# Altium schematic sheet STM32_MCU.SchDoc
size B
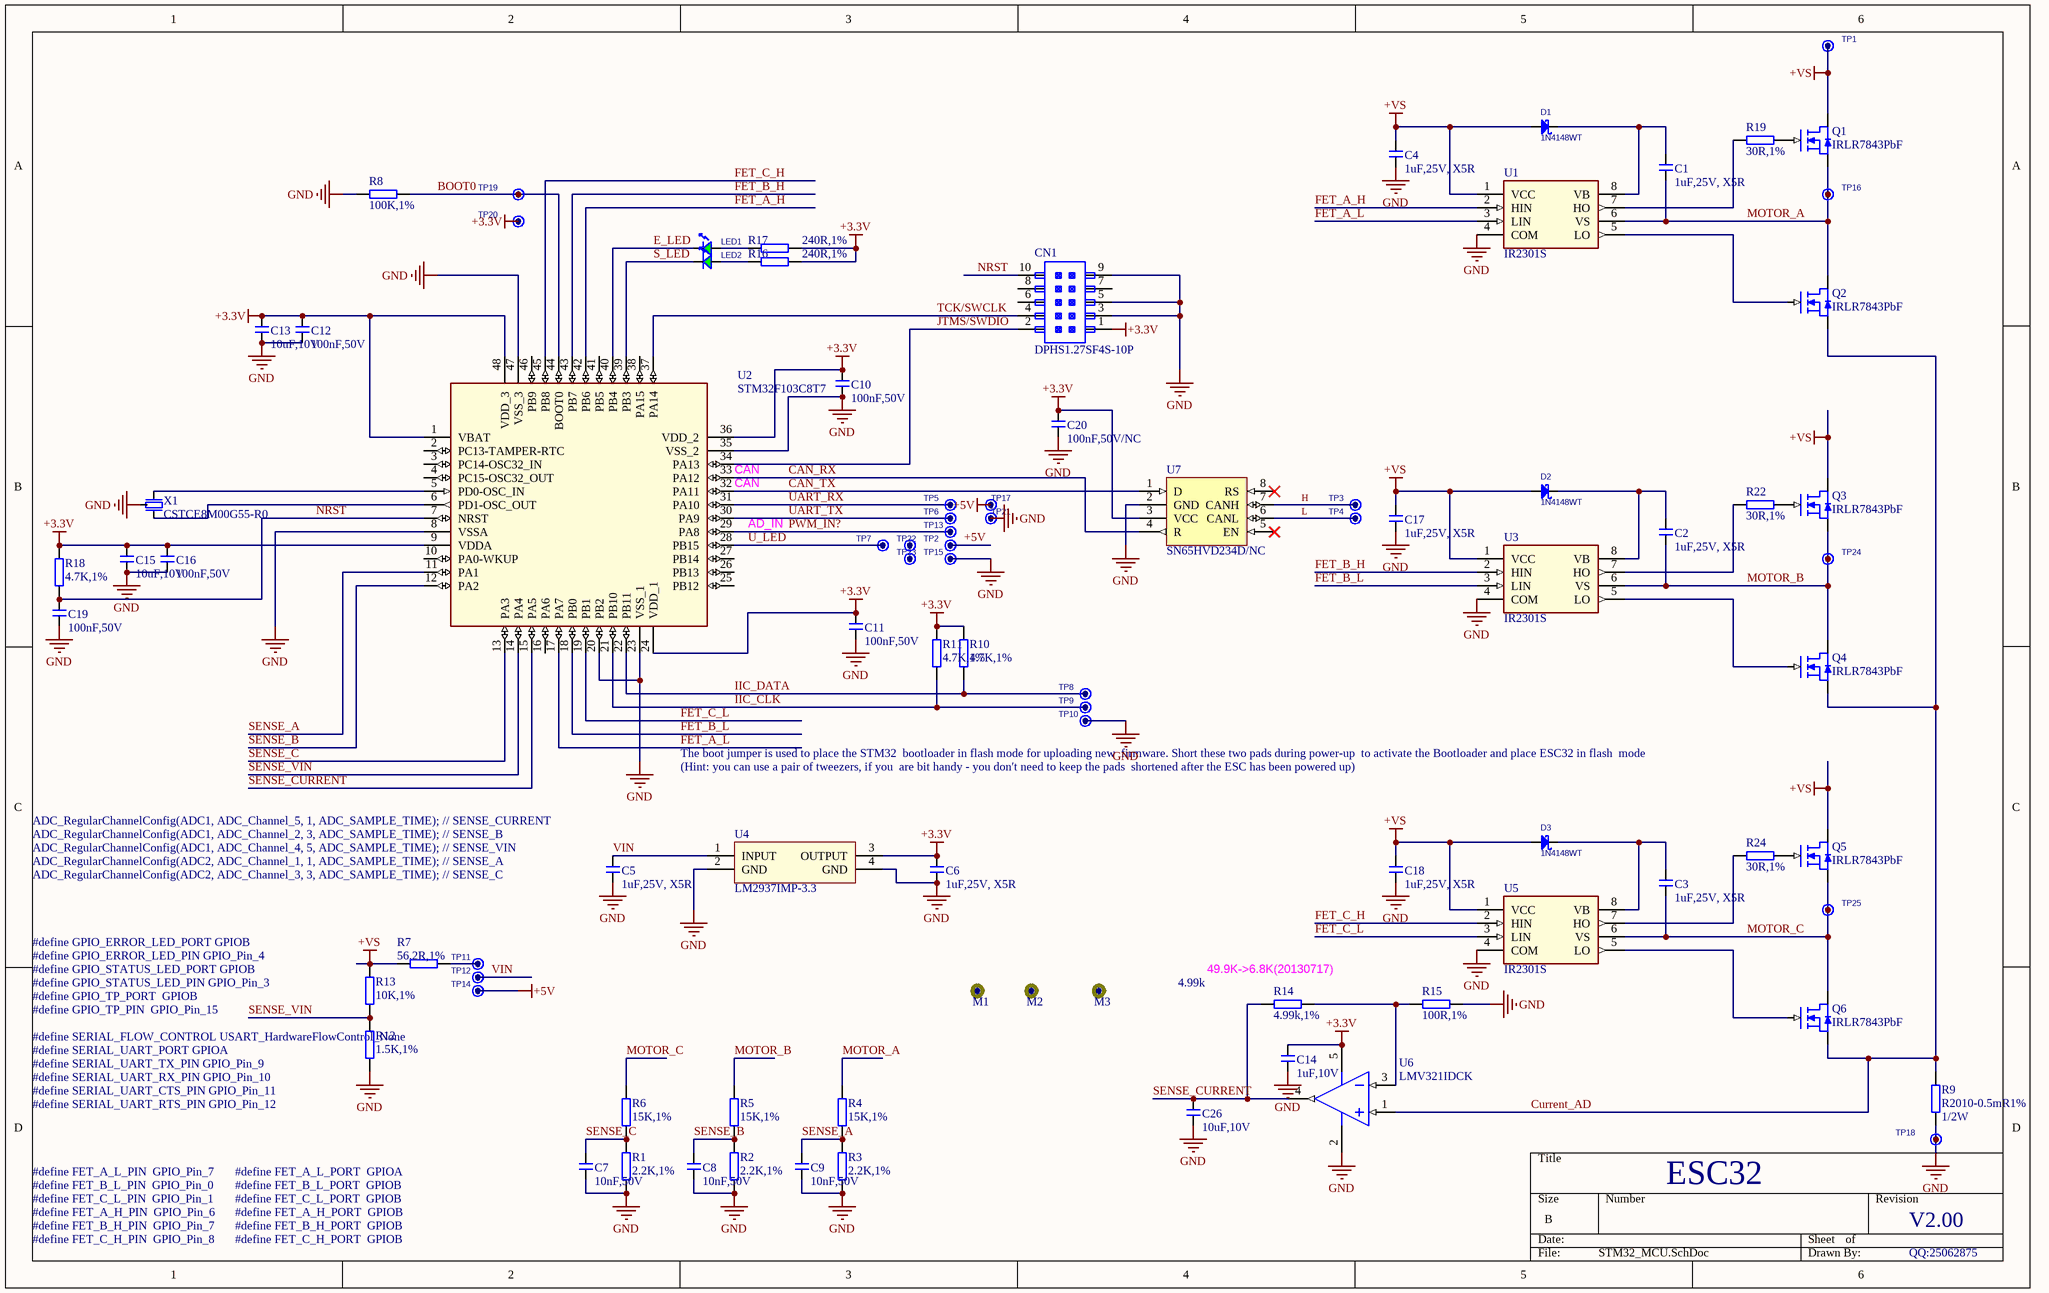
[diagram p0: STM32_MCU.SchDoc]

## Parts
C1  value 1uF,25V, X5R  [CAPC2012L]  (hidden comment: C0805-1uF/25V)
C2  value 1uF,25V, X5R  [CAPC2012L]  (hidden comment: C0805-1uF/25V)
C3  value 1uF,25V, X5R  [CAPC2012L]  (hidden comment: C0805-1uF/25V)
C4  value 1uF,25V, X5R  [CAPC2012L]  (hidden comment: C0805-1uF/25V)
C5  value 1uF,25V, X5R  [CAPC2012L]  (hidden comment: C0805-1uF/25V)
C6  value 1uF,25V, X5R  [CAPC2012L]  (hidden comment: C0805-1uF/25V)
C7  value 10nF,50V  [CAPC1608L]  (hidden comment: C0603-10nF/50V)
C8  value 10nF,50V  [CAPC1608L]  (hidden comment: C0603-10nF/50V)
C9  value 10nF,50V  [CAPC1608L]  (hidden comment: C0603-10nF/50V)
C10  value 100nF,50V  [CAPC1608L]  (hidden comment: C0603-100nF/50V)
C11  value 100nF,50V  [CAPC1608L]  (hidden comment: C0603-100nF/50V)
C12  value 100nF,50V  [CAPC1608L]  (hidden comment: C0603-100nF/50V)
C13  value 10uF,10V  [CAPC1608L]  (hidden comment: C0603-10uF/10V)
C14  value 1uF,10V  [CAPC1608L]  (hidden comment: C0603-1uF/10V)
C15  value 10uF,10V  [CAPC1608L]  (hidden comment: C0603-10uF/10V)
C16  value 100nF,50V  [CAPC1608L]  (hidden comment: C0603-100nF/50V)
C17  value 1uF,25V, X5R  [CAPC2012L]  (hidden comment: C0805-1uF/25V)
C18  value 1uF,25V, X5R  [CAPC2012L]  (hidden comment: C0805-1uF/25V)
C19  value 100nF,50V  [CAPC1608L]  (hidden comment: C0603-100nF/50V)
C20  value 100nF,50V/NC  [CAPC1608L]  (hidden comment: C0603-100nF/50V/NC)
C26  value 10uF,10V  [CAPC1608L]  (hidden comment: C0603-10uF/10V)
CN1  DPHS1.27SF4S-10P  [DPHS1.27SF4S-10P]
D1  1N4148WT  [DIOM1608X06N]
D2  1N4148WT  [DIOM1608X06N]
D3  1N4148WT  [DIOM1608X06N]
LED1  LED-R0603  [LED-G0603]  (value not drawn)
LED2  LED-G0603  [LED-G0603]  (value not drawn)
M1  MarkPad  [MarkPad]  (value not drawn)  (no BOM)
M2  MarkPad  [MarkPad]  (value not drawn)  (no BOM)
M3  MarkPad  [MarkPad]  (value not drawn)  (no BOM)
Q1  IRLR7843PbF  [TO230P990X239-3N]
Q2  IRLR7843PbF  [TO230P990X239-3N]
Q3  IRLR7843PbF  [TO230P990X239-3N]
Q4  IRLR7843PbF  [TO230P990X239-3N]
Q5  IRLR7843PbF  [TO230P990X239-3N]
Q6  IRLR7843PbF  [TO230P990X239-3N]
R1  value 2.2K,1%  [RESC1608L]  (hidden comment: R0603-2.2K)
R2  value 2.2K,1%  [RESC1608L]  (hidden comment: R0603-2.2K)
R3  value 2.2K,1%  [RESC1608L]  (hidden comment: R0603-2.2K)
R4  value 15K,1%  [RESC1608L]  (hidden comment: R0603-15K)
R5  value 15K,1%  [RESC1608L]  (hidden comment: R0603-15K)
R6  value 15K,1%  [RESC1608L]  (hidden comment: R0603-15K)
R7  value 56.2R,1%  [RESC2012L]  (hidden comment: R0805-56.2R)
R8  value 100K,1%  [RESC1608L]  (hidden comment: R0603-100K)
R9  R2010-0.5mR1%  功?: 1/2W  [RC2010-5025X07N]
R10  value 4.7K,1%  [RESC1608L]  (hidden comment: R0603-4.7K)
R11  value 4.7K,1%  [RESC1608L]  (hidden comment: R0603-4.7K)
R12  value 1.5K,1%  [RESC1608L]  (hidden comment: R0603-1.5K)
R13  value 10K,1%  [RESC1608L]  (hidden comment: R0603-10K)
R14  value 4.99k,1%  [RESC1608L]  (hidden comment: R0603-4.99k)
R15  value 100R,1%  [RESC1608L]  (hidden comment: R0603-100R)
R16  value 240R,1%  [RESC1608L]  (hidden comment: R0603-240R)
R17  value 240R,1%  [RESC1608L]  (hidden comment: R0603-240R)
R18  value 4.7K,1%  [RESC1608L]  (hidden comment: R0603-4.7K)
R19  value 30R,1%  [RESC1608L]  (hidden comment: R0603-30R)
R22  value 30R,1%  [RESC1608L]  (hidden comment: R0603-30R)
R24  value 30R,1%  [RESC1608L]  (hidden comment: R0603-30R)
TP1  TPS50mil  [TP3]  (value not drawn)  (no BOM)
TP2  TPS50mil  [TPS1.5mm]  (value not drawn)  (no BOM)
TP3  TPS50mil  [TPS1.5mm]  (value not drawn)  (no BOM)
TP4  TPS50mil  [TPS1.5mm]  (value not drawn)  (no BOM)
TP5  TPS50mil  [TPS1.5mm]  (value not drawn)  (no BOM)
TP6  TPS50mil  [TPS1.5mm]  (value not drawn)  (no BOM)
TP7  TPS50mil  [TPS1.5mm]  (value not drawn)  (no BOM)
TP8  TPS50mil  [TPS1.5mm]  (value not drawn)  (no BOM)
TP9  TPS50mil  [TPS1.5mm]  (value not drawn)  (no BOM)
TP10  TPS50mil  [TPS1.5mm]  (value not drawn)  (no BOM)
TP11  TPS50mil  [TP1]  (value not drawn)  (no BOM)
TP12  TPS50mil  [TP2]  (value not drawn)  (no BOM)
TP13  TPS50mil  [TPS1.5mm]  (value not drawn)  (no BOM)
TP14  TPS50mil  [TP1]  (value not drawn)  (no BOM)
TP15  TPS50mil  [TPS1.5mm]  (value not drawn)  (no BOM)
TP16  TPS50mil  [TP3]  (value not drawn)  (no BOM)
TP17  TPS50mil  [TPS1.5mm]  (value not drawn)  (no BOM)
TP18  TPS50mil  [TP3]  (value not drawn)  (no BOM)
TP19  TPS50mil  [TPS1.5mm]  (value not drawn)  (no BOM)
TP20  TPS50mil  [TPS1.5mm]  (value not drawn)  (no BOM)
TP21  TPS50mil  [TPS1.5mm]  (value not drawn)  (no BOM)
TP22  TPS50mil  [TPS1.5mm]  (value not drawn)  (no BOM)
TP23  TPS50mil  [TPS1.5mm]  (value not drawn)  (no BOM)
TP24  TPS50mil  [TP3]  (value not drawn)  (no BOM)
TP25  TPS50mil  [TP3]  (value not drawn)  (no BOM)
U1  IR2301S  [SOIC127P600X175-8L]
U2  STM32F103C8T7  [TSQFP50P900X900X160-48L]
U3  IR2301S  [SOIC127P600X175-8L]
U4  LM2937IMP-3.3  [SOT230P700X180-4N]
U5  IR2301S  [SOIC127P600X175-8L]
U6  LMV321IDCK  [SOT65P210X110-5L(SC70)]
U7  SN65HVD234D/NC  [SOIC127P600X175-8M]
X1  CSTCE8M00G55-R0  [CSTCE_G]

## Nets
+3.3V: C6.1 C10.1 C11.1 C12.1 C13.1 C14.1 C15.1 C16.1 C20.1 CN1.1 R10.2 R11.2 R16.2 R17.2 R18.2 TP20.1 U2.1(VBAT) U2.9(VDDA) U2.24(VDD_1) U2.36(VDD_2) U2.48(VDD_3) U4.3(OUTPUT) U6.5(V+) U7.3(VCC)
+5V: TP2.1 TP14.1 TP17.1
+VS: C4.1 C17.1 C18.1 D1.1(A) D2.1(A) D3.1(A) Q1.4(D) Q3.4(D) Q5.4(D) R7.2 R13.2 TP1.1 U1.1(VCC) U3.1(VCC) U5.1(VCC)
GND: C4.2 C5.2 C6.2 C7.2 C8.2 C9.2 C10.2 C11.2 C12.2 C13.2 C14.2 C15.2 C16.2 C17.2 C18.2 C19.2 C20.2 C26.2 CN1.3 CN1.5 CN1.9 R1.1 R2.1 R3.1 R8.2 R9.1 R12.1 R15.1 TP10.1 TP15.1 TP18.1 TP21.1 U1.4(COM) U2.8(VSSA) U2.20(PB2) U2.23(VSS_1) U2.35(VSS_2) U2.47(VSS_3) U3.4(COM) U4.2(GND) U4.4(GND) U5.4(COM) U6.2(GND) U7.2(GND) X1.2(GND)
BOOT0: R8.1 TP19.1 U2.44(BOOT0)
CAN_RX: U2.33(PA12) U7.4(R)
CAN_TX: U2.32(PA11) U7.1(D)
Current_AD: Q2.3(S) Q4.3(S) Q6.3(S) R9.2 U6.1(IN1+)
E_LED: LED1.2(K) U2.40(PB4)
FET_A_H: U1.2(HIN) U2.42(PB6)
FET_A_L: U1.3(LIN) U2.17(PA7)
FET_B_H: U2.43(PB7) U3.2(HIN)
FET_B_L: U2.18(PB0) U3.3(LIN)
FET_C_H: U2.45(PB8) U5.2(HIN)
FET_C_L: U2.19(PB1) U5.3(LIN)
H: TP3.1 U7.7(CANH)
IIC_CLK: R11.1 TP9.1 U2.21(PB10)
IIC_DATA: R10.1 TP8.1 U2.22(PB11)
JTMS/SWDIO: CN1.2 U2.34(PA13)
L: TP4.1 U7.6(CANL)
MOTOR_A: C1.2 Q1.3(S) Q2.4(D) R4.2 TP16.1 U1.6(VS)
MOTOR_B: C2.2 Q3.3(S) Q4.4(D) R5.2 TP24.1 U3.6(VS)
MOTOR_C: C3.2 Q5.3(S) Q6.4(D) R6.2 TP25.1 U5.6(VS)
NRST: C19.1 CN1.10 R18.1 U2.7(NRST)
PWM_IN?: TP13.1 U2.29(PA8)
S_LED: LED2.2(K) U2.39(PB3)
SENSE_A: C9.1 R3.2 R4.1 U2.11(PA1)
SENSE_B: C8.1 R2.2 R5.1 U2.12(PA2)
SENSE_C: C7.1 R1.2 R6.1 U2.13(PA3)
SENSE_CURRENT: C26.1 R14.2 U2.15(PA5) U6.4(OUT1)
SENSE_VIN: R12.2 R13.1 U2.14(PA4)
TCK/SWCLK: CN1.4 U2.37(PA14)
U_LED: TP7.1 U2.28(PB15)
UART_RX: TP5.1 U2.31(PA10)
UART_TX: TP6.1 U2.30(PA9)
VIN: C5.1 TP12.1 U4.1(INPUT)
NetC1_1: C1.1 D1.2(K) U1.8(VB)
NetC2_1: C2.1 D2.2(K) U3.8(VB)
NetC3_1: C3.1 D3.2(K) U5.8(VB)
NetLED1_1: LED1.1(A) R17.1
NetLED2_1: LED2.1(A) R16.1
NetQ1_1: Q1.1(G) R19.2
NetQ2_1: Q2.1(G) U1.5(LO)
NetQ3_1: Q3.1(G) R22.2
NetQ4_1: Q4.1(G) U3.5(LO)
NetQ5_1: Q5.1(G) R24.2
NetQ6_1: Q6.1(G) U5.5(LO)
NetR7_1: R7.1 TP11.1
NetR14_1: R14.1 R15.2 U6.3(IN1-)
NetR19_1: R19.1 U1.7(HO)
NetR22_1: R22.1 U3.7(HO)
NetR24_1: R24.1 U5.7(HO)
NetU2_5: U2.5(PD0-OSC_IN) X1.1
NetU2_6: U2.6(PD1-OSC_OUT) X1.3

Not connected (* = marked no-connect by the designer): CN1 6 7 8; M1 1; M2 1; M3 1; TP22 1; TP23 1; U2 2(PC13-TAMPER-RTC) 3(PC14-OSC32_IN) 4(PC15-OSC32_OUT) 10(PA0-WKUP) 16(PA6) 25(PB12) 26(PB13) 27(PB14) 38(PA15) 41(PB5) 46(PB9); U7 5(EN)* 8(RS)*

## Notes on the sheet
- (near U2) CAN
- (near U2) AD_IN
- The boot jumper is used to place the STM32  bootloader in flash mode for uploading new  firmware. Short these two pads during power-up  to activate the Bootloader and place ESC32 in flash  mode
- (Hint: you can use a pair of tweezers, if you  are bit handy - you don′t need to keep the pads  shortened after the ESC has been powered up)
- ADC_RegularChannelConfig(ADC1, ADC_Channel_5, 1, ADC_SAMPLE_TIME); // SENSE_CURRENT
- ADC_RegularChannelConfig(ADC1, ADC_Channel_2, 3, ADC_SAMPLE_TIME); // SENSE_B
- ADC_RegularChannelConfig(ADC1, ADC_Channel_4, 5, ADC_SAMPLE_TIME); // SENSE_VIN
- ADC_RegularChannelConfig(ADC2, ADC_Channel_1, 1, ADC_SAMPLE_TIME); // SENSE_A
- ADC_RegularChannelConfig(ADC2, ADC_Channel_3, 3, ADC_SAMPLE_TIME); // SENSE_C
- #define GPIO_ERROR_LED_PORT GPIOB
- #define GPIO_ERROR_LED_PIN GPIO_Pin_4
- #define GPIO_STATUS_LED_PORT GPIOB
- (near R14) 49.9K->6.8K(20130717)
- #define GPIO_STATUS_LED_PIN GPIO_Pin_3
- #define GPIO_TP_PORT  GPIOB
- #define GPIO_TP_PIN  GPIO_Pin_15
- (near R12) #define SERIAL_FLOW_CONTROL USART_HardwareFlowControl_None
- (near R14) 4.99k
- #define SERIAL_UART_RTS_PIN GPIO_Pin_12
- #define SERIAL_UART_CTS_PIN GPIO_Pin_11
- #define SERIAL_UART_RX_PIN GPIO_Pin_10
- #define SERIAL_UART_TX_PIN GPIO_Pin_9
- #define SERIAL_UART_PORT GPIOA
- #define FET_A_L_PIN  GPIO_Pin_7
- #define FET_A_L_PORT  GPIOA
- #define FET_B_L_PIN  GPIO_Pin_0
- #define FET_C_L_PIN  GPIO_Pin_1
- #define FET_A_H_PIN  GPIO_Pin_6
- #define FET_B_H_PIN  GPIO_Pin_7
- #define FET_C_H_PIN  GPIO_Pin_8
- #define FET_C_H_PORT  GPIOB
- #define FET_B_H_PORT  GPIOB
- #define FET_A_H_PORT  GPIOB
- #define FET_C_L_PORT  GPIOB
- #define FET_B_L_PORT  GPIOB
- ESC32
- V2.00
- QQ:25062875

## Library data of the parts
C1-C6 C17 C18 = C0805-1uF/25V: X5R,20%; Mfr P/N: C2012X5R1E105K
C7-C12 C16 C19 C20 C26 = C0603-100nF/50V: X7R
C13 C15 = C0603-10uF/10V: X5R,20%
C14 = C0603-1uF/10V: X5R,20%
CN1 = DPHS1: 1.27 间距表贴双排针, 40芯, PCB板高度为4.3mm
D1-D3 = 1N4148WT: SURFACE MOUNT FAST SWITCHING DIODE; Mfr: DIODES; TOPMARK: T4
LED1 LED2 = LED-G0603: LED发光二极管, 绿色, 0603封装
M1-M3 = MarkPad: mark, 标记芯片和板边位置
R1-R3 = R0603-2.2K: 2.2K,1%; Tolerance: 1%
R4-R6 = R0603-10K: 10K,1%; Tolerance: 1%
R7 = R0805-56.2R: 56.2R,1%; Tolerance: -
R8 R13 = R0603-100K: 100K,1%; Tolerance: 1%
R9 = R: Vishay WSL功率型电阻; 器?: -; 制?: Vishay
R10 R11 R18 = R0603-4.7K: 4.7K,1%; Tolerance: 1%
R12 = R0603-15K: 15K,1%; Tolerance: 1%
R14 = R0603-49.9K: 4.99k,1%; Tolerance: 1%
R15 = R0603-100R: 100R,1%; Tolerance: 1%
R16 R17 = R0603-240R: 240R,1%; Tolerance: 1%
R19 R22 R24 = R0603-22R: 22R,1%; Tolerance: 1%
TP1-TP25 = TPS50mil: Test Point, 12x25mil, Not Populated
U7 = SN65HVD234D: 3.3-V CAN TRANSCEIVERS